# EAGLE design Dozimetr (EAGLE 9.4.2)
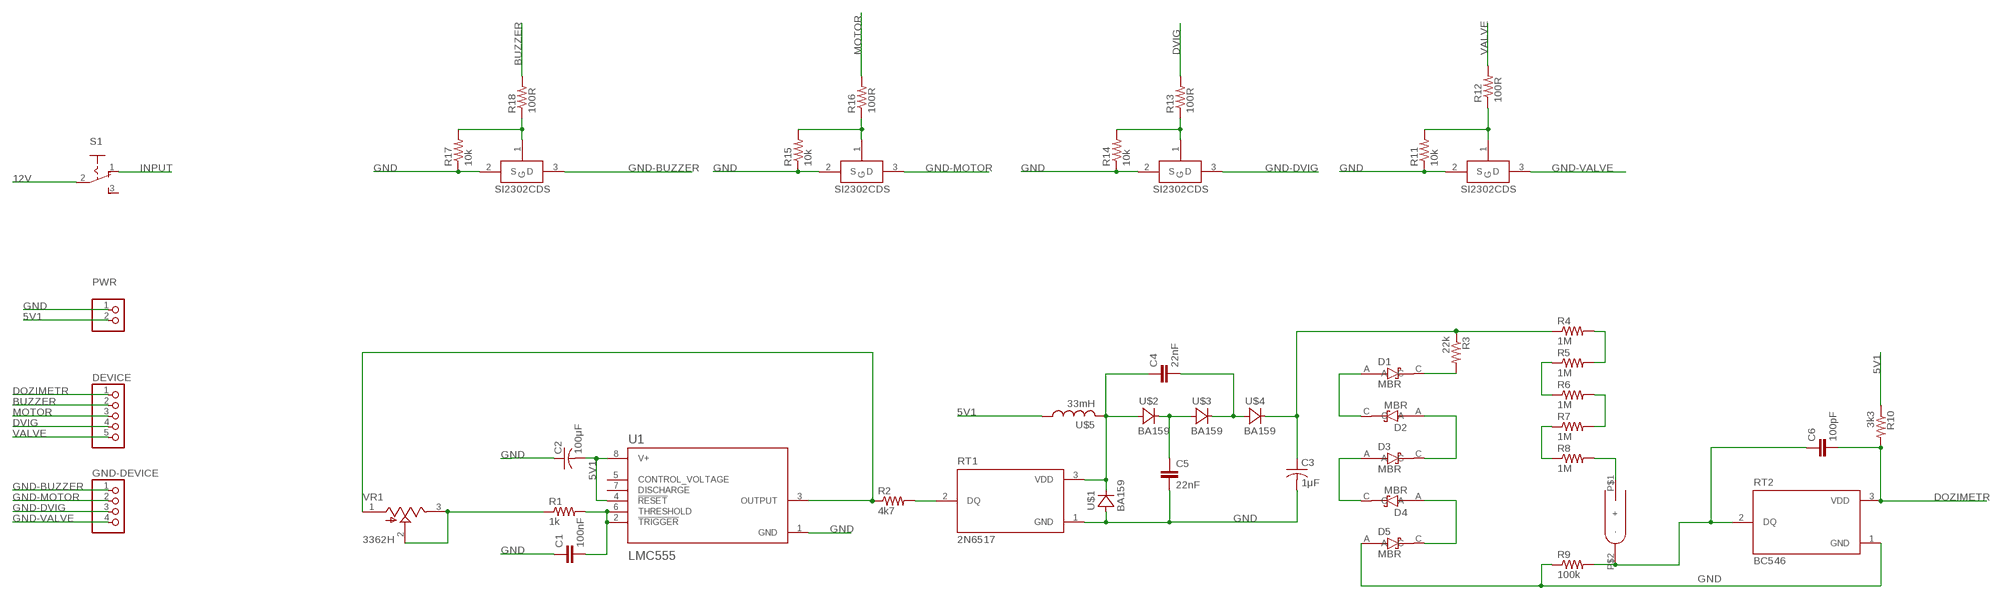
[diagram p0: schematic, sheet 1]

## Parts
C1  100nF  C-EUC0603  [C0603]
C2  100μF  ECAPECAP100  [ECAP100-CMD]
C3  1μF  ECAP  [ECAP1MK]
C4  22nF  C-EUC1210  [C1210]
C5  22nF  C-EUC1210  [C1210]
C6  100pF  C-EUC0603  [C0603]
D1  MBR  DIODE-MBR  [SOD123]
D2  MBR  DIODE-MBR  [SOD123]
D3  MBR  DIODE-MBR  [SOD123]
D4  MBR  DIODE-MBR  [SOD123]
D5  MBR  DIODE-MBR  [SOD123]
DEVICE  PINHD-1X5  [1X05]
DOSE  DOSIM_SBM20-1  [DOSIM_SBM20-1]
GND-DEVICE  PINHD-1X4  [1X04]
PWR  PINHD-1X2  [1X02]
R1  1k  R-US_R0603  [R0603]
R2  4k7  R-US_R0603  [R0603]
R3  22k  R-US_R0603  [R0603]
R4  1M  R-US_R0603  [R0603]
R5  1M  R-US_R0603  [R0603]
R6  1M  R-US_R0603  [R0603]
R7  1M  R-US_R0603  [R0603]
R8  1M  R-US_R0603  [R0603]
R9  100k  R-US_R0603  [R0603]
R10  3k3  R-US_R0603  [R0603]
R11  10k  R-US_R0603  [R0603]
R12  100R  R-US_R0603  [R0603]
R13  100R  R-US_R0603  [R0603]
R14  10k  R-US_R0603  [R0603]
R15  10k  R-US_R0603  [R0603]
R16  100R  R-US_R0603  [R0603]
R17  10k  R-US_R0603  [R0603]
R18  100R  R-US_R0603  [R0603]
RT1  2N6517  [TO92/TO226]
RT2  BC546  [TO92/TO226]
S1  SWITCH-BIG  [SWITCH-BIG]
SI2302-1  SI2302CDS  [SOT23-3]
SI2302-2  SI2302CDS  [SOT23-3]
SI2302-3  SI2302CDS  [SOT23-3]
SI2302-4  SI2302CDS  [SOT23-3]
U1  LMC555  LMC555CMX/NOPB  [SOIC127P599X175-8N]
U$1  BA159  [BA159]
U$2  BA159  [BA159]
U$3  BA159  [BA159]
U$4  BA159  [BA159]
U$5  33mH  RCH114NP  [RCH114NP_-]
VR1  3362H  3362H-1-502LF  [TRIM_3362H-1-502LF]

## Nets
5V1: C2.P$2 PWR.2 R10.1 U1.4(!RESET!) U1.8(V+) U$5.P$1
12V: S1.2(P)
BUZZER: DEVICE.2 R18.2
DOZIMETR: C6.2 DEVICE.1 R10.2 RT2.3(VDD)
DVIG: DEVICE.4 R13.2
GND: C1.1 C2.P$1 C3.P$2 C5.2 D5.A PWR.1 R9.1 R11.1 R14.1 R15.1 R17.1 RT1.1(GND) RT2.1(GND) SI2302-1.2(S) SI2302-2.2(S) SI2302-3.2(S) SI2302-4.2(S) U1.1(GND) U$1.P$1(A)
GND-BUZZER: GND-DEVICE.1 SI2302-1.3(D)
GND-DVIG: GND-DEVICE.3 SI2302-3.3(D)
GND-MOTOR: GND-DEVICE.2 SI2302-2.3(D)
GND-VALVE: GND-DEVICE.4 SI2302-4.3(D)
INPUT: S1.1(O)
MOTOR: DEVICE.3 R16.2
N$1: C1.2 R1.2 U1.2(!TRIGGER!) U1.6(THRESHOLD)
N$2: R1.1 VR1.2(WIPER) VR1.3(CW)
N$3: R2.1 U1.3(OUTPUT) VR1.1(CCW)
N$4: C4.1 RT1.3(VDD) U$1.P$2(C) U$2.P$1(A) U$5.P$2
N$5: R2.2 RT1.2(DQ)
N$6: C5.1 U$2.P$2(C) U$3.P$1(A)
N$7: C4.2 U$3.P$2(C) U$4.P$1(A)
N$8: C3.P$1 R3.1 R4.1 U$4.P$2(C)
N$9: D4.A D5.C
N$10: D3.A D4.C
N$11: D2.A D3.C
N$12: D1.A D2.C
N$13: D1.C R3.2
N$14: R4.2 R5.2
N$15: R5.1 R6.1
N$16: R6.2 R7.2
N$17: R7.1 R8.1
N$18: DOSE.P$1(+) R8.2
N$19: C6.1 DOSE.P$2(-) R9.2 RT2.2(DQ)
N$25: R17.2 R18.1 SI2302-1.1(G)
N$28: R15.2 R16.1 SI2302-2.1(G)
N$30: R13.1 R14.2 SI2302-3.1(G)
N$31: R11.2 R12.1 SI2302-4.1(G)
VALVE: DEVICE.5 R12.2
Unconnected: S1.3(S) U1.5(CONTROL_VOLTAGE) U1.7(DISCHARGE)

## Library data of the parts
C1 C4-C6 = rcl:C-EU: CAPACITOR, European symbol; SPICEPREFIX: C
C2 C3 = CanCubeSat:ECAP
D1-D5 = CanCubeSat:DIODE-MBR: Rectifier, Schottky Power; Plastic Sod-123; 0.5 a @ +90c If; +125; 20v; 1000 Check prices <https://pricing.snapeda.com/parts/MBR0520LT1G/ON%20Semiconductor/view-part?ref=eda>; AVAILABILITY: Good; DESCRIPTION: Diode Schottky 20V 500mA Surface Mount SOD-123; MF: ON Semiconductor; MP: MBR0520LT1G; PACKAGE: SOD-123-2 ON Semiconductor; PRICE: None; PURCHASE-URL: https://pricing.snapeda.com/search/part/MBR0520LT1G/?ref=eda
DEVICE = pinhead:PINHD-1X5: PIN HEADER
DOSE = CanCubeSat:DOSIM_SBM20-1
GND-DEVICE = pinhead:PINHD-1X4: PIN HEADER
PWR = CanCubeSat:PINHD-1X2: PIN HEADER
R1-R18 = rcl:R-US_: RESISTOR, American symbol; SPICEPREFIX: R
RT1 = CanCubeSat:2N6517: Temperature Sensor Digital, Local -55°C ~ 125°C 7 b TO-92-3 Check prices <https://pricing.snapeda.com/parts/DS1820/Maxim%20Integrated/view-part?ref=eda>; AVAILABILITY: Bad; DESCRIPTION: Temperature Sensor Digital, Local -55°C ~ 125°C 9 b TO-92-3; MF: Maxim Integrated; MP: DS1820; PACKAGE: TO-226-3 Maxim; PRICE: None
RT2 = CanCubeSat:BC546: Temperature Sensor Digital, Local -55°C ~ 125°C 7 b TO-92-3 Check prices <https://pricing.snapeda.com/parts/DS1820/Maxim%20Integrated/view-part?ref=eda>; AVAILABILITY: Bad; DESCRIPTION: Temperature Sensor Digital, Local -55°C ~ 125°C 9 b TO-92-3; MF: Maxim Integrated; MP: DS1820; PACKAGE: TO-226-3 Maxim; PRICE: None
S1 = CanCubeSat:SWITCH-BIG: SLIDING SWITCH Distributor Buerklin, 11G810
SI2302-1-SI2302-4 = CanCubeSat:SI2302CDS
U1 = LMC555CMX_NOPB:LMC555CMX/NOPB: Worlds smallest 555 timer with low power, high accuracy and a Fmax of 3MHz 8-SOIC -40 to 85 Check availability <https://pricing.snapeda.com/parts/LMC555CMX/Texas%20Instruments/view-part?ref=eda>; AVAILABILITY: In Stock; DESCRIPTION: Worlds smallest 555 timer with low power, high accuracy and a Fmax of 3MHz 8-SOIC -40 to 85; MF: Texas Instruments; MP: LMC555CMX; PACKAGE: SOIC-8 Texas Instruments; PRICE: None
U$1-U$4 = CanCubeSat:BA159
U$5 = CanCubeSat:RCH114NP
VR1 = CanCubeSat:3362H-1-502LF: Res Cermet Trimmer 50K Ohm 10% 1/2W 1(Elec)/1(Mech)Turn 2.77mm (6.6 X 6.99 X 4.7mm) Pin Thru-Hole Tube Check prices <https://pricing.snapeda.com/parts/3362P-1-502LF/Bourns/view-part?ref=eda>; AVAILABILITY: Good; DESCRIPTION: 5 kOhms 0.5W, 1/2W PC Pins Through Hole Trimmer Potentiometer Cermet 1 Turn Top Adjustment; MF: Bourns; MP: 3362P-1-502LF; PACKAGE: 3362P-1 Bourns Inc.; PRICE: None; PURCHASE-URL: https://pricing.snapeda.com/search/part/3362P-1-502LF/?ref=eda

## Board
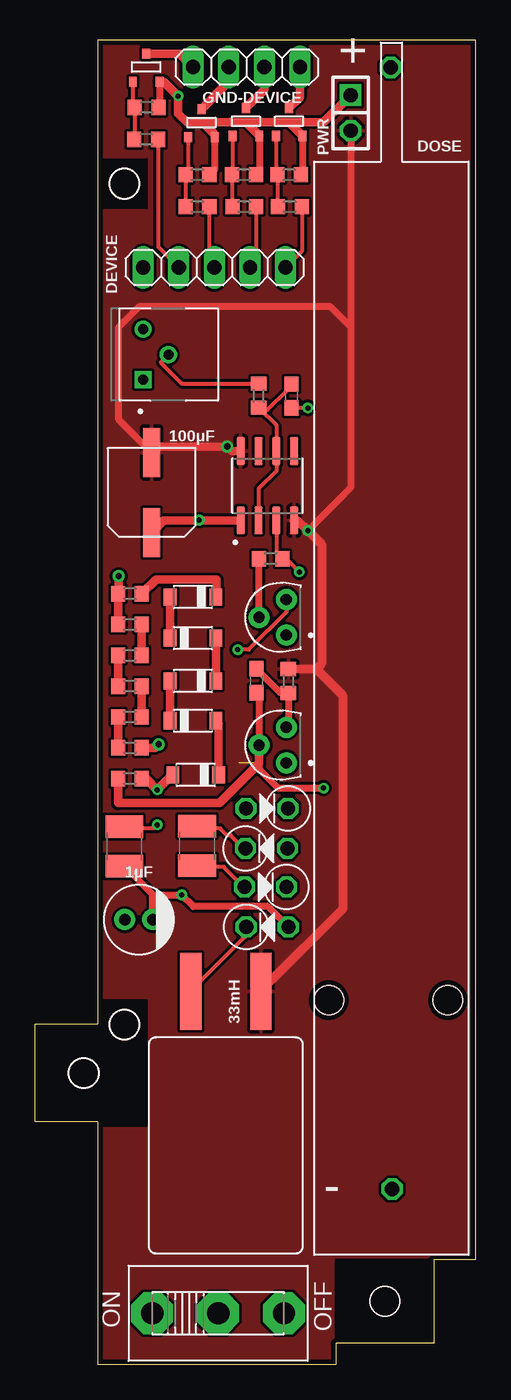
[diagram p1: board, top side]
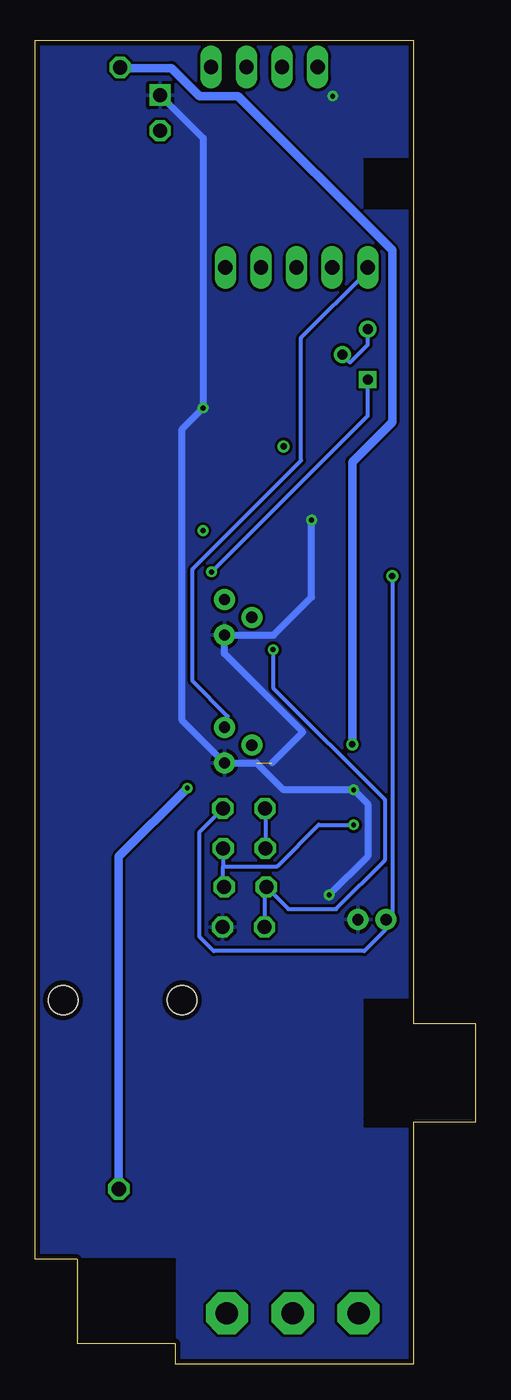
[diagram p2: board, bottom side, seen from below]

Size 31.47 x 94.5 mm. Coordinates in mm from the lower left corner, seen from the top.
Outline: 4.47,0 21.47,0 21.47,1.5 28.47,1.5 28.47,7.5 31.47,7.5 31.47,94.5 4.47,94.5 4.47,24.3 0,24.3 0,17.3 4.47,17.3 4.47,0
Copper layers (1*16): Top 0.035mm / dielectric 1.5mm / Bottom 0.035mm
Design rules "default *": minimum track width 0.3mm, minimum drill 0.35mm, track to track 0.2mm, track to pad 0.2mm, pad to pad 0.2mm, via to via 0.2mm, smd to smd 0.2mm, copper to edge 0.35mm, drill to drill 6mil, minimum pad ring 10mil, minimum via ring 8mil, stop-mask expansion 4mil, vias tented up to drill 0mil, thermal gap 10mil
Holes 2.1 mm at 20.97,26 29.47,26

### Footprints (pad centres in the part's own frame; a part is rotated, then mirrored left to right if it is on the bottom)
C0603 = smd 1.1 x 1: 1 -0.85,0; 2 0.85,0
ECAP100-CMD = smd 1.2 x 3.5: P$1 0,2.85; P$2 0,-2.85
ECAP1MK = drill 0.8 pad 1.5: P$1 -1,0; P$2 1,0
C1210 = smd 1.6 x 2.7: 1 -1.4,0; 2 1.4,0
SOD123 = smd 0.91 x 1.22: A 1.635,0; C -1.635,0
1X05 = drill 1.016 long: 1 -5.08,0; 2 -2.54,0; 3 0,0; 4 2.54,0; 5 5.08,0
DOSIM_SBM20-1 = drill 1.016 octagon: P$1 -0.05,1.73; P$2 0.05,-78.3
1X04 = drill 1.016 long: 1 -3.81,0; 2 -1.27,0; 3 1.27,0; 4 3.81,0
1X02 = drill 1.016 square: 1 -1.27,0 | drill 1.016 octagon: 2 1.27,0
R0603 = smd 1 x 1.1: 1 -0.85,0; 2 0.85,0
TO92/TO226 = drill 0.8 pad 1.5: 1 -1.27,-0.95; 2 0,1; 3 1.27,-0.95
SWITCH-BIG = drill 1.6 pad 3 octagon: 1 -4.7,0; 2 0,0; 3 4.7,0
SOT23-3 = smd 0.56 x 0.73: 1 -0.95,-1; 2 0.95,-1; 3 0,1
SOIC127P599X175-8N = smd 1.97 x 0.6: 1 -2.47,1.905; 2 -2.47,0.635; 3 -2.47,-0.635; 4 -2.47,-1.905; 5 2.47,-1.905; 6 2.47,-0.635; 7 2.47,0.635; 8 2.47,1.905
BA159 = drill 1 octagon: P$1 -1.5,0; P$2 1.5,0
RCH114NP_- = smd 5.5 x 1.5: P$1 3.8,-2.5; P$2 3.8,2.5
TRIM_3362H-1-502LF = drill 0.714 square: 1 -1.8,1.8 | drill 0.714: 2 0,0; 3 1.8,1.8

### Placement (x,y rotation side)
C1  18.31,69.1 90 top
C2  8.32,62.22 180 top
C3  7.41,31.74 0 top
C4  11.56,36.99 90 top
C5  6.38,36.96 270 top
C6  15.81,48.78 90 top
D1  11.27,54.77 180 top
D2  11.27,51.83 0 top
D3  11.27,48.77 180 top
D4  11.27,45.93 0 top
D5  11.47,42.07 180 top
DEVICE  12.8,78.27 0 top
DOSE  25.44,90.82 0 top
GND-DEVICE  15.1,92.57 0 top
PWR  22.54,89.3 270 top
R1  15.96,69.12 270 top
R2  16.83,57.49 180 top
R3  6.77,54.99 0 top
R4  6.77,52.8 0 top
R5  6.77,50.6 0 top
R6  6.77,48.4 0 top
R7  6.77,46.2 0 top
R8  6.77,44 0 top
R9  6.77,41.8 180 top
R10  18.08,48.76 270 top
R11  18.15,84.89 180 top
R12  18.19,82.61 0 top
R13  14.94,82.61 0 top
R14  14.91,84.89 180 top
R15  11.59,84.89 180 top
R16  11.59,82.61 0 top
R17  7.97,89.69 180 top
R18  7.94,87.41 0 top
RT1  16.99,53.31 90 top
RT2  16.99,44.19 90 top
S1  13.07,3.65 0 top
SI2302-1  7.93,92.53 0 top
SI2302-2  11.88,88.56 0 top
SI2302-3  15.06,88.66 0 top
SI2302-4  18.14,88.66 0 top
U1  16.59,62.7 90 top
U$1  16.58,31.21 180 top
U$2  16.46,34.07 0 top
U$3  16.53,36.83 180 top
U$4  16.56,39.67 0 top
U$5  13.62,22.83 90 top
VR1  9.52,72.06 90 top

### Tracks (layer width: path | path; a pad name or v marks a point on that pad's centre or on a via)
5V1  (via drill 0.35, 0.45)
  Top 0.3: 16.47,27 16.22,26.75 U$5.P$1
  Top 0.5: PWR.2 22.54,74 | 22.54,74 22.54,62.57 v19.47,59.5 | C2.P$2 5.97,67.42 5.97,74 7.47,75.5 21.04,75.5 22.54,74
  Top 0.6: R10.1 20.08,49.61 | 20.08,49.61 20.47,50 20.47,58.5 v19.47,59.5 18.74,60.23 U1.4 | 20.08,49.61 21.97,47.72 21.97,32.5 16.47,27 | U1.8 14.05,65.17 v13.72,65.5 8.75,65.5 C2.P$2
  pour Top: -1.53,-1.5 33.47,-1.5 33.47,96.5 -1.53,96.5
  cutout Top: -0.03,24.5 3.97,24.5 3.97,26 7.97,26 7.97,17.5 7.97,17 -0.03,17
  cutout Top: 4.47,86 7.97,86 7.97,82.5 4.47,82.5
  cutout Top: 21.47,1.5 21.47,7.5 28.47,7.5 28.47,1.5
BUZZER
  Top 0.3: R18.2 8.79,79.74 DEVICE.2
DOZIMETR
  Top 0.5: C6.2 17.53,47.91 R10.2 18.08,45.6 RT2.3
  Bottom 0.3: DEVICE.1 7.72,78 12.47,73.25 12.47,64.5 20.22,56.75 20.22,48.75 17.72,46.25 17.72,45.5 RT2.3
DVIG
  Top 0.3: R13.2 15.79,78.72 DEVICE.4
GND  (via drill 0.35)  (1 unrouted)
  Top 0.3: 15.97,87.75 SI2302-3.2 | 19.22,87.75 SI2302-4.2 | v19.47,68.25 C1.1 | 18.13,88.62 17.97,88.62
  Top 0.5: SI2302-2.2 12.83,85.28 R15.1 | SI2302-3.2 16.01,85.14 R14.1 | SI2302-4.2 19.09,84.98 R11.1 | SI2302-1.2 8.88,89.75 R17.1 | U$1.P$1 16.63,32.67 11.31,32.67 v10.47,33.5 8.44,33.5 8.41,33.53 | C3.P$2 8.41,33.53 | C5.2 8.41,33.53
  Top 0.6: D5.A 9.79,42.07 v8.72,41 7.92,41.8 R9.1 | C2.P$1 9.18,60.23 11.7,60.23 v11.72,60.25 11.74,60.23 U1.1 | PWR.1 20.6,88.62 18.13,88.62 SI2302-4.2 | 17.97,88.62 15.05,88.62 | SI2302-3.2 15.05,88.62 | 15.05,88.62 11.97,88.62 | SI2302-2.2 12.83,87.77 11.97,88.62 | 11.97,88.62 10.85,88.62 10.22,89.25 v10.22,90.5 9.19,91.53 SI2302-1.2
  Bottom 0.5: PWR.1 19.47,87.5 v19.47,68.25 20.97,66.75 20.97,45.95 RT2.1 15.64,42.92 13.72,41 v8.72,41 7.72,40 7.72,36.25 v10.47,33.5 | v11.72,60.25 11.72,54.75 14.43,52.04 RT1.1 17.94,50.72 12.35,45.12 14.55,42.92
  pour Bottom: -0.53,-0.5 -0.53,95.5 32.47,95.5 32.47,-0.5
  cutout Bottom: 4.47,86 7.97,86 7.97,82.5 4.47,82.5
  cutout Bottom: -0.03,24.5 3.97,24.5 3.97,26 7.97,26 7.97,17.5 7.97,17 -0.03,17
  cutout Bottom: 21.47,1.5 21.47,7.5 28.47,7.5 28.47,1.5
GND-BUZZER
  Top 0.6: GND-DEVICE.1 10.33,93.53 SI2302-1.3
GND-DVIG
  Top 0.6: GND-DEVICE.3 16.37,90.97 SI2302-3.3
GND-MOTOR
  Top 0.6: SI2302-2.3 13.83,91.51 GND-DEVICE.2
GND-VALVE
  Top 0.6: GND-DEVICE.4 18.91,90.43 SI2302-4.3
MOTOR
  Top 0.3: R16.2 12.44,78.63 DEVICE.3
N$1
  Top 0.3: 15.97,68 15.97,68.25 R1.2 | 15.97,68 16.47,68 18.22,69.75 C1.2 | 15.97,68 R1.2 | R1.2 17.22,67.01 17.22,65 U1.6 17.23,63.76 15.96,62.48 U1.2
N$2
  Top 0.3: R1.1 15.72,70 10.47,70 8.98,71.49 VR1.2
  Bottom 0.3: VR1.3 7.72,72.75 8.98,71.49 VR1.2
N$3  (via drill 0.35)
  Top 0.3: 17.22,60 U1.3 17.23,57.95 R2.1 17.93,57.49 v18.87,56.55
  Bottom 0.3: VR1.1 7.72,67.7 v18.87,56.55
N$4  (via drill 0.35)
  Top 0.3: C4.1 11.72,35.5 13.47,35.5 14.47,34.5 14.72,34.5 14.97,34.25 U$2.P$1 | U$5.P$2 11.22,26.75 14.97,30.5 14.97,31 U$1.P$2 | v14.47,51 v14.48,51.01 15.25,51.01 17.94,53.7 RT1.3
  Bottom 0.3: U$1.P$2 15.08,33.95 U$2.P$1 13.39,32.5 9.97,32.5 6.49,35.98 6.49,40.3 14.47,48.28 v14.47,51
N$5
  Top 0.5: RT1.2 R2.2
N$6  (via drill 0.35)
  Top 0.3: v8.72,38.5 8.47,38.25 6.47,38.25 C5.1
  Bottom 0.3: v8.72,38.5 11.22,38.5 14.17,35.55 18.03,35.55 | U$3.P$1 18.03,35.55 | U$2.P$2 18.03,34.14 18.03,35.55
N$7
  Top 0.3: C4.2 11.72,38.25 13.22,38.25 13.72,37.75 13.97,37.75 14.97,36.75 U$3.P$2
  Bottom 0.3: U$4.P$1 14.97,39.5 14.97,37 U$3.P$2
N$8  (via drill 0.45)
  Top 0.6: R4.1 R3.1 5.97,55.04 v5.97,56.25
  Bottom 0.3: U$4.P$2 18.22,39.5 19.72,38 19.72,30.5 18.72,29.5 7.97,29.5 6.47,31 6.47,31.68 C3.P$1 5.97,32.18 v5.97,56.25
N$9
  Top 0.6: D4.A 13.11,45.73 D5.C
N$10
  Top 0.6: D3.A D4.C
N$11
  Top 0.6: D2.A D3.C
N$12
  Top 0.6: D1.A D2.C
N$13
  Top 0.5: 12.97,55 12.97,54.84 D1.C
  Top 0.6: R3.2 8.63,56 12.97,56 12.97,55
N$14
  Top 0.6: R5.2 R4.2
N$15
  Top 0.6: R6.1 R5.1
N$16
  Top 0.6: R7.2 R6.2
N$17
  Top 0.6: R8.1 R7.1
N$18  (via drill 0.45)
  Top 0.6: v8.82,44.25 8.57,44 R8.2
  Bottom 0.6: DOSE.P$1 25.34,92.5 21.72,92.5 19.72,90.5 16.97,90.5 5.97,79.5 5.97,67.25 8.82,64.4 v8.82,44.25
N$19  (via drill 0.35)
  Top 0.5: v20.6,41.12 17.35,41.12 15.99,42.48 RT2.2 15.99,47.75 C6.1
  Top 0.6: R9.2 5.92,40.05 13.16,40.05 15.99,42.88 RT2.2 15.81,44.37
  Bottom 0.6: DOSE.P$2 25.49,36.23 v20.6,41.12
N$25
  Top 0.3: SI2302-1.1 6.98,89.83 R17.2 7.12,87.44 R18.1
N$28
  Top 0.3: 10.93,82.8 10.8,82.67 | 10.8,82.67 R16.1 | SI2302-2.1 10.93,85.08 R15.2 10.74,82.73 10.8,82.67
N$30
  Top 0.3: 14.22,87.5 SI2302-3.1 14.11,84.94 R14.2 14.06,82.89 14.21,82.74 | 14.22,82.75 14.21,82.74 | 14.21,82.74 R13.1
N$31
  Top 0.3: 17.22,87.5 SI2302-4.1 | 17.22,82.75 R12.1 17.3,82.65 R11.2 17.19,85 SI2302-4.1 | 17.22,87.75 SI2302-4.1
VALVE
  Top 0.3: R12.2 19.04,79.43 DEVICE.5